# EAGLE design board (EAGLE 5.06)
DRAWING_NAME: Flash breakout board; REV: 1
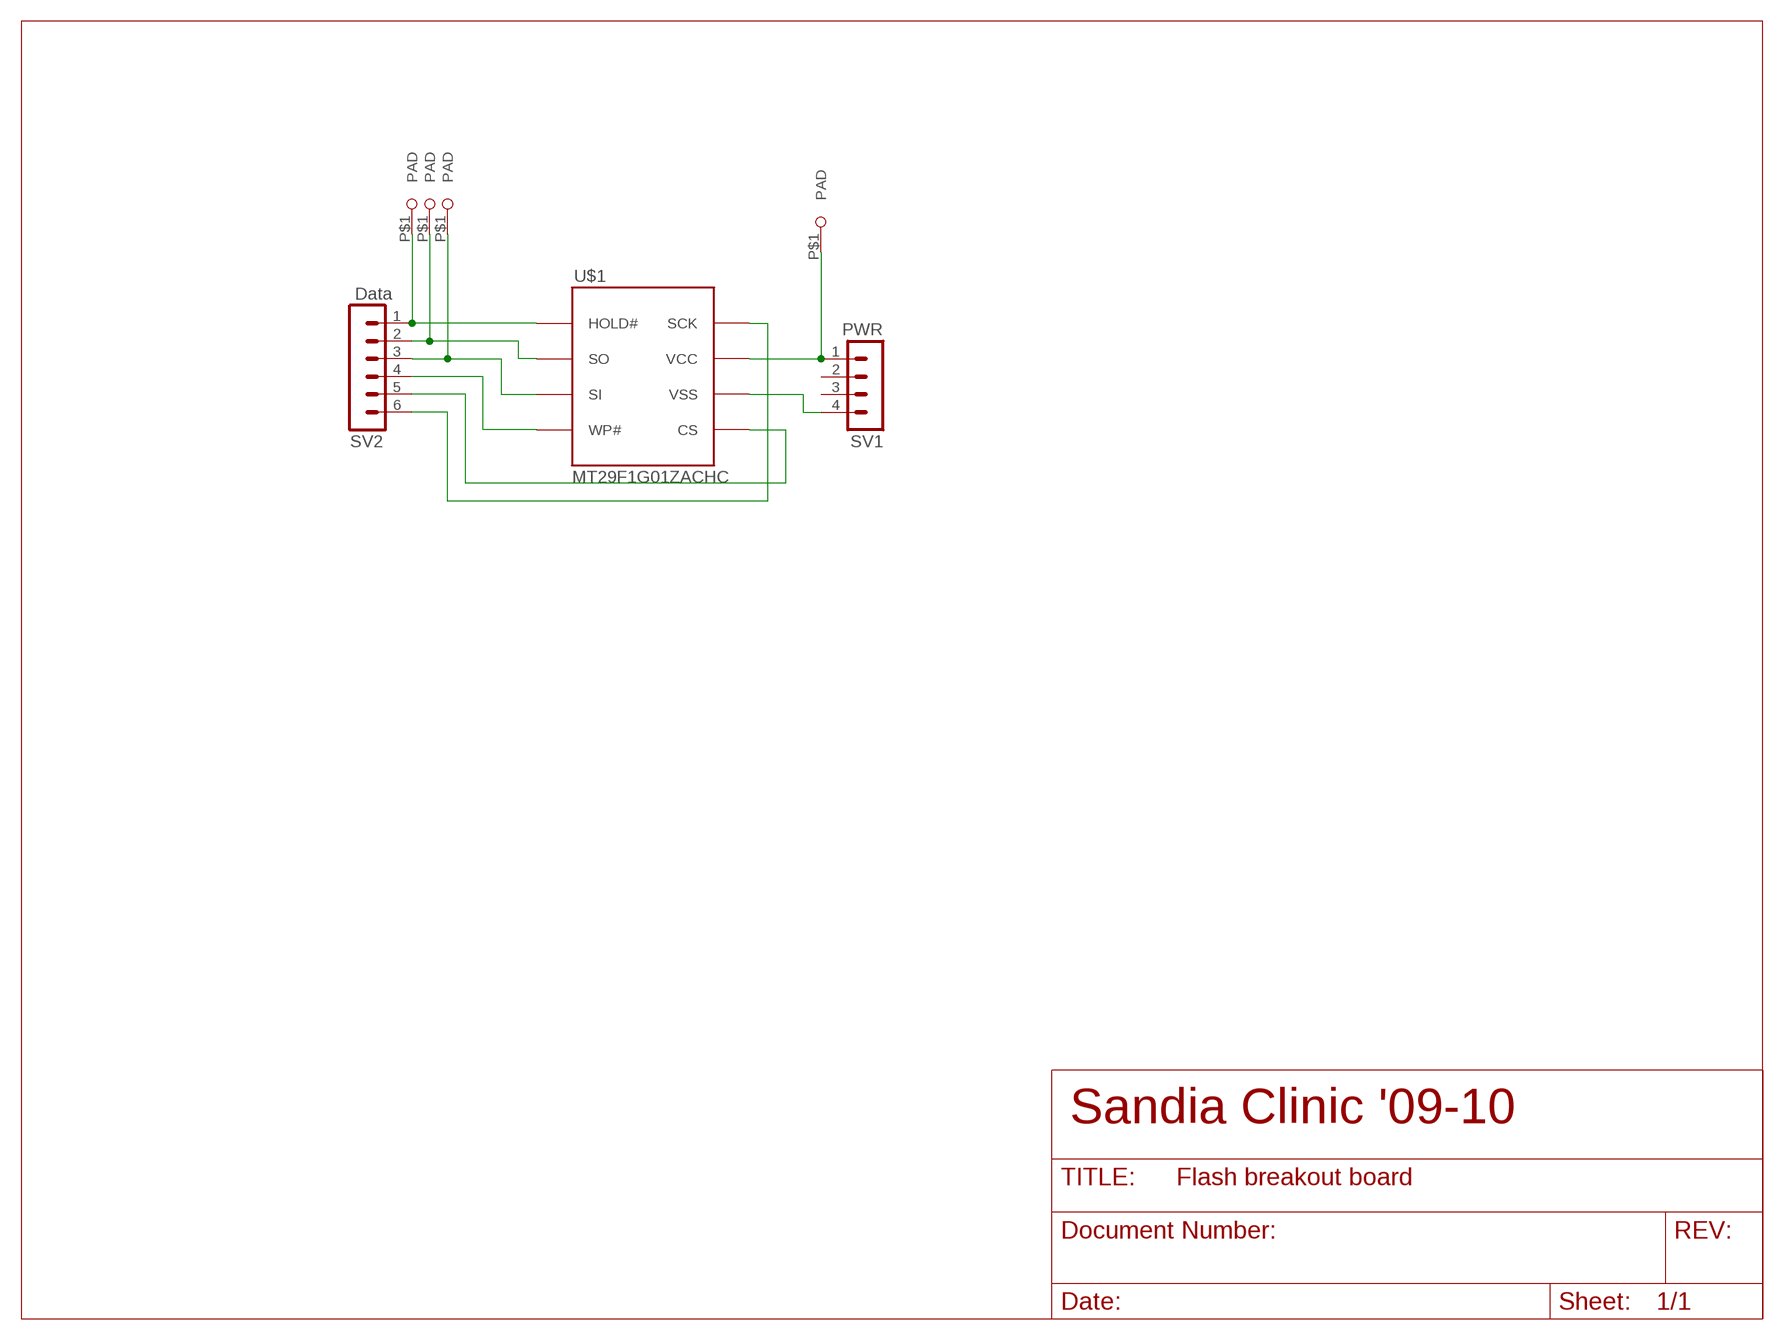
[diagram p0: schematic, sheet 1]

## Parts
SV1  PWR  MA04-1  [MA04-1]
SV2  Data  MA06-1  [MA06-1]
U$1  MT29F1G01ZACHC  [63-BALL_VFBGA]
U$2  PADPAD  [PAD,0.45MM-DIAM]
U$3  PADPAD  [PAD,0.45MM-DIAM]
U$4  PADPAD  [PAD,0.45MM-DIAM]
U$5  PADPAD  [PAD,0.45MM-DIAM]

## Nets
N$1: U$4.P$1(PAD)
N$4: SV2.4 U$1.J8(WP#)
N$5: SV1.1 U$1.G6(VCC)
N$6: SV1.4 U$1.K3(VSS)
N$7: SV2.5 U$1.K7(CS)
N$8: SV2.6 U$1.K6(SCK)
N$9: SV2.1 U$1.G5(HOLD#) U$3.P$1(PAD)
N$10: SV2.2 U$1.G7(SO)
N$11: SV2.3 U$1.J7(SI) U$5.P$1(PAD)
N$12: U$2.P$1(PAD)
Unconnected: SV1.2 SV1.3

## Notes on the sheet
- Sandia Clinic '09-10

## Library data of the parts
SV1 = con-lstb:MA04-1: PIN HEADER
SV2 = con-lstb:MA06-1: PIN HEADER
U$1 = mylib:MT29F1G01ZACHC
U$2-U$5 = mylib:PAD

## Board
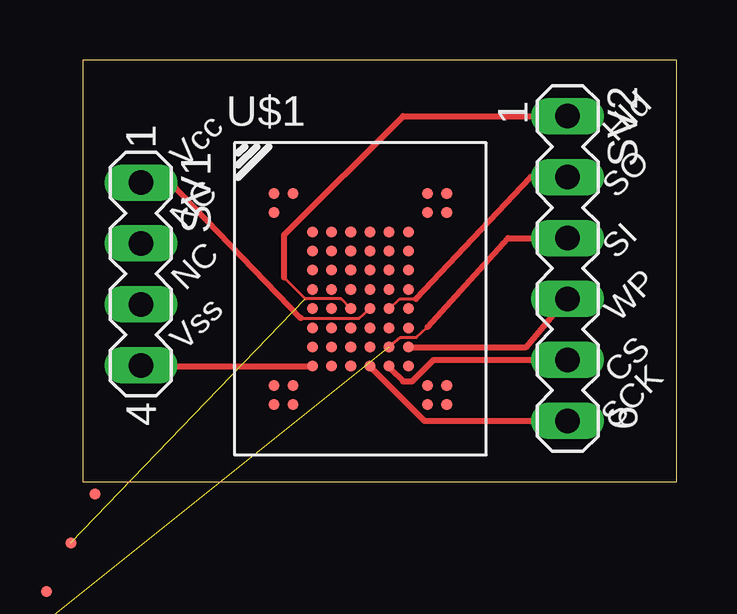
[diagram p1: board, top side]

Size 24.75 x 17.58 mm. Coordinates in mm from the lower left corner, seen from the top.
Outline: 0,0 24.75,0 24.75,17.58 0,17.58 0,0
Copper layers (1*16): Top 0.035mm / dielectric 1.5mm / Bottom 0.035mm
Design rules "default *": minimum track width 0.1168mm, minimum drill 24mil, track to track 0.1156mm, track to pad 0.1156mm, pad to pad 5mil, via to via 5mil, smd to smd 5mil, copper to edge 40mil, drill to drill 8mil, minimum pad ring 10mil, minimum via ring 8mil, stop-mask expansion 4mil, vias tented up to drill 0mil, thermal gap 10mil

### Footprints (pad centres in the part's own frame; a part is rotated, then mirrored left to right if it is on the bottom)
MA04-1 = drill 1.016 long: 1 -3.81,0; 2 -1.27,0; 3 1.27,0; 4 3.81,0
MA06-1 = drill 1.016 long: 1 -6.35,0; 2 -3.81,0; 3 -1.27,0; 4 1.27,0; 5 3.81,0; 6 6.35,0
63-BALL_VFBGA = smd 0.45 x 0.45: A1 -3.6,4.4; A2 -2.8,4.4; A9 2.8,4.4; A10 3.6,4.4; B1 -3.6,3.6; B9 2.8,3.6; B10 3.6,3.6; C3 -2,2.8; C4 -1.2,2.8; C5 -0.4,2.8; C6 0.4,2.8; C7 1.2,2.8; C8 2,2.8; D3 -2,2; D4 -1.2,2; D5 -0.4,2; D6 0.4,2; D7 1.2,2; D8 2,2; E3 -2,1.2; E4 -1.2,1.2; E5 -0.4,1.2; E6 0.4,1.2; E7 1.2,1.2; E8 2,1.2; F3 -2,0.4; F4 -1.2,0.4; F5 -0.4,0.4; F6 0.4,0.4; F7 1.2,0.4; F8 2,0.4; G3 -2,-0.4; G4 -1.2,-0.4; G5 -0.4,-0.4; G6 0.4,-0.4; G7 1.2,-0.4; G8 2,-0.4; H3 -2,-1.2; H4 -1.2,-1.2; H5 -0.4,-1.2; H6 0.4,-1.2; J3 -2,-2; J4 -1.2,-2; J5 -0.4,-2; J6 0.4,-2; J7 1.2,-2; J8 2,-2; K3 -2,-2.8; K4 -1.2,-2.8; K5 -0.4,-2.8; K6 0.4,-2.8; K7 1.2,-2.8; K8 2,-2.8; L1 -3.6,-3.6; L2 -2.8,-3.6; L9 2.8,-3.6; L10 3.6,-3.6; M1 -3.6,-4.4; M2 -2.8,-4.4; M9 2.8,-4.4; M10 3.6,-4.4; P$8 1.2,-1.2; P$12 2,-1.2
PAD,0.45MM-DIAM = smd 0.45 x 0.45: P$1 0,0

### Placement (x,y rotation side)
SV1  2.41,8.66 270 top
SV2  20.19,8.89 270 top
U$1  11.56,7.62 0 top
U$2  0.51,-0.51 0 top
U$3  -0.51,-2.54 0 top
U$4  -1.52,-4.57 0 top  (outside the outline)
U$5  -2.54,-6.6 0 top  (outside the outline)

### Tracks (layer width: path | path; a pad name or v marks a point on that pad's centre or on a via)
N$4
  Top 0.254: SV2.4 19.61,6.99 18.47,5.61 13.64,5.61 U$1.J8
N$5
  Top 0.117: 9.08,6.82 11.51,6.82 U$1.G6
  Top 0.254: SV1.1 3.66,12.47 9.08,6.82
N$6
  Top 0.254: SV1.4 2.92,4.83 9.53,4.83 U$1.K3
N$7
  Top 0.254: SV2.5 14.61,5.08 13.72,4.19 13.34,4.19 12.83,4.7 U$1.K7
N$8
  Top 0.254: SV2.6 14.22,2.54 12.06,4.7 U$1.K6
N$9  (1 unrouted)
  Top 0.117: 9.27,7.62 10.76,7.62 U$1.G5
  Top 0.127: 9.27,7.62 8.38,8.51
  Top 0.254: SV2.1 13.34,15.24 8.38,10.29 8.38,8.51
N$10
  Top 0.117: 13.87,7.62 13.21,7.62 U$1.G7
  Top 0.254: SV2.2 18.64,12.7 13.87,7.62
N$11  (1 unrouted)
  Top 0.117: 13.89,6.02 13.23,6.02 U$1.J7
  Top 0.127: 13.89,6.02 14.35,6.45
  Top 0.254: SV2.3 17.7,10.16 17.5,9.93 14.35,6.45

### Text on the board
tPlace: Hld | Vcc | SO | NC | SI | NC | WP | Vss | CS | SCK